# Altium schematic sheet PCB_Slave_Traffic_Light_COVER_PAGE.SchDoc
size A3; SheetNumber: 3; SheetTotal: 3
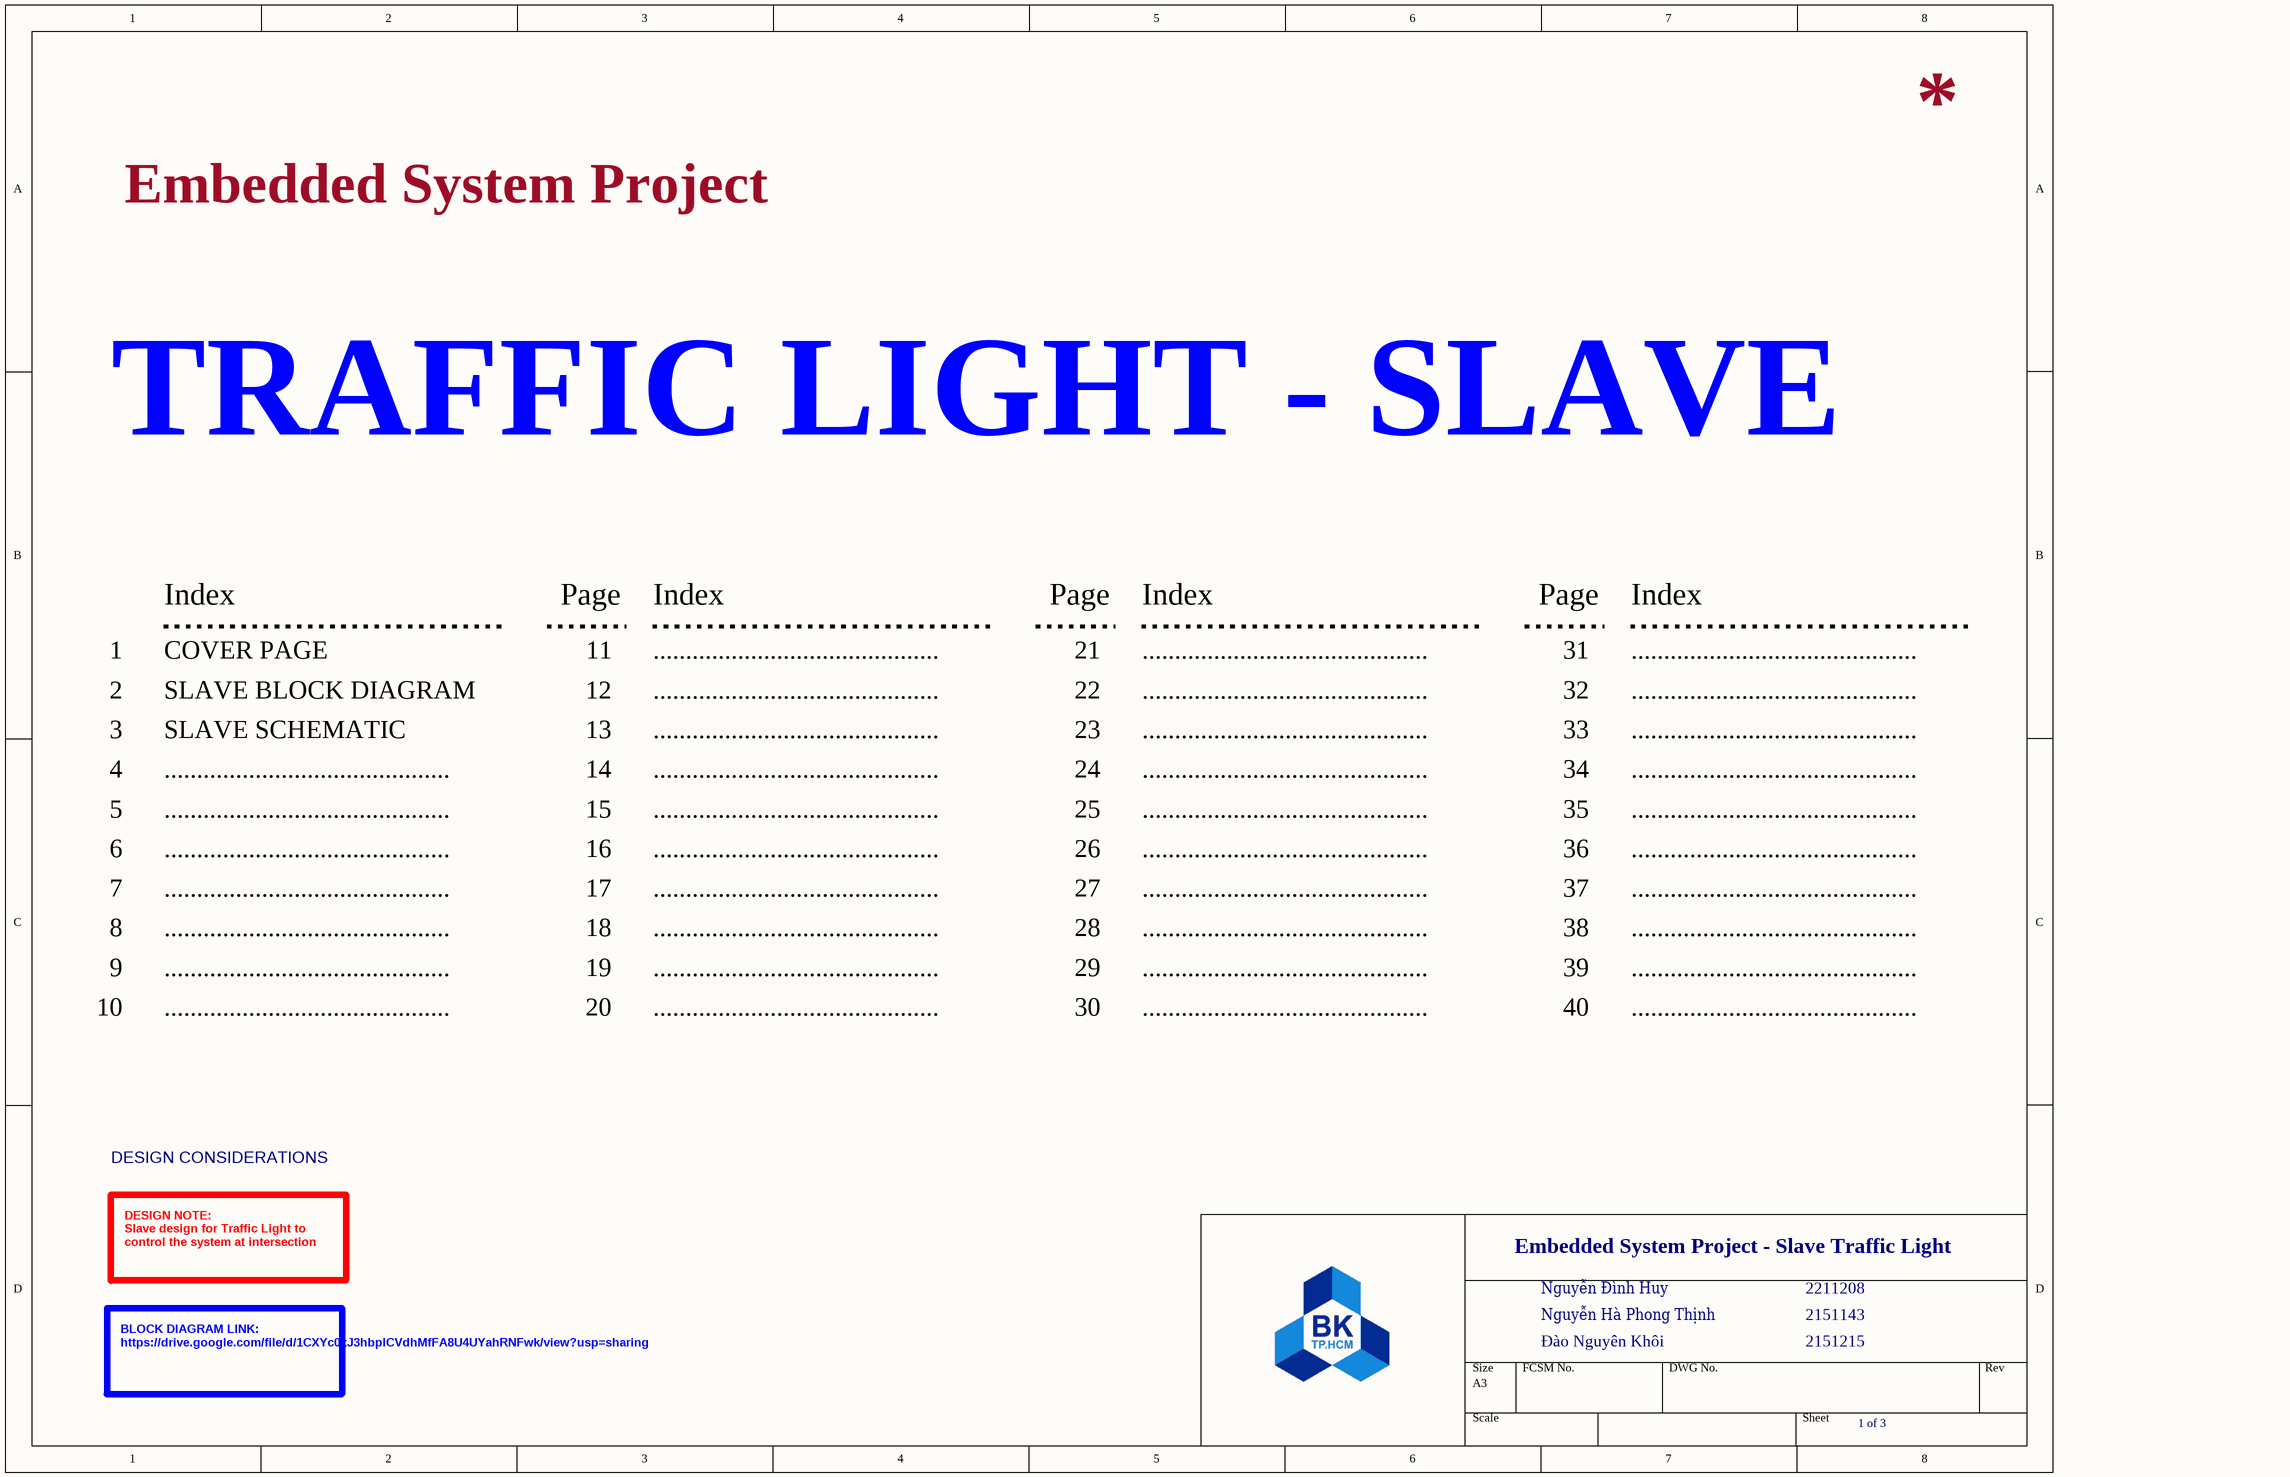
[diagram p0: PCB_Slave_Traffic_Light_COVER_PAGE.SchDoc]

## Notes on the sheet
- Embedded System Project
- TRAFFIC LIGHT - SLAVE
- Index
- Page
- 1
- 2
- COVER PAGE
- SLAVE BLOCK DIAGRAM
- 11
- 12
- ............................................
- 21
- 22
- 31
- 32
- 3
- SLAVE SCHEMATIC
- 13
- 23
- 33
- 4
- 5
- 14
- 15
- 24
- 25
- 34
- 35
- 6
- 7
- 16
- 17
- 26
- 27
- 36
- 37
- 8
- 18
- 28
- 38
- 9
- 10
- 19
- 20
- 29
- 30
- 39
- 40
- DESIGN CONSIDERATIONS
- DESIGN NOTE:
  Slave design for Traffic Light to control the system at intersection
- Embedded System Project - Slave Traffic Light
- Nguyễn Đình Huy
- 2211208
- Nguyễn Hà Phong Thịnh
- Đào Nguyên Khôi
- 2151143
- 2151215
- BLOCK DIAGRAM LINK:
  https://drive.google.com/file/d/1CXYc0xJ3hbplCVdhMfFA8U4UYahRNFwk/view?usp=sharing
- 1 of 3